# EasyEDA Pro project ProPrj_STM32H750.epro, board PCB1
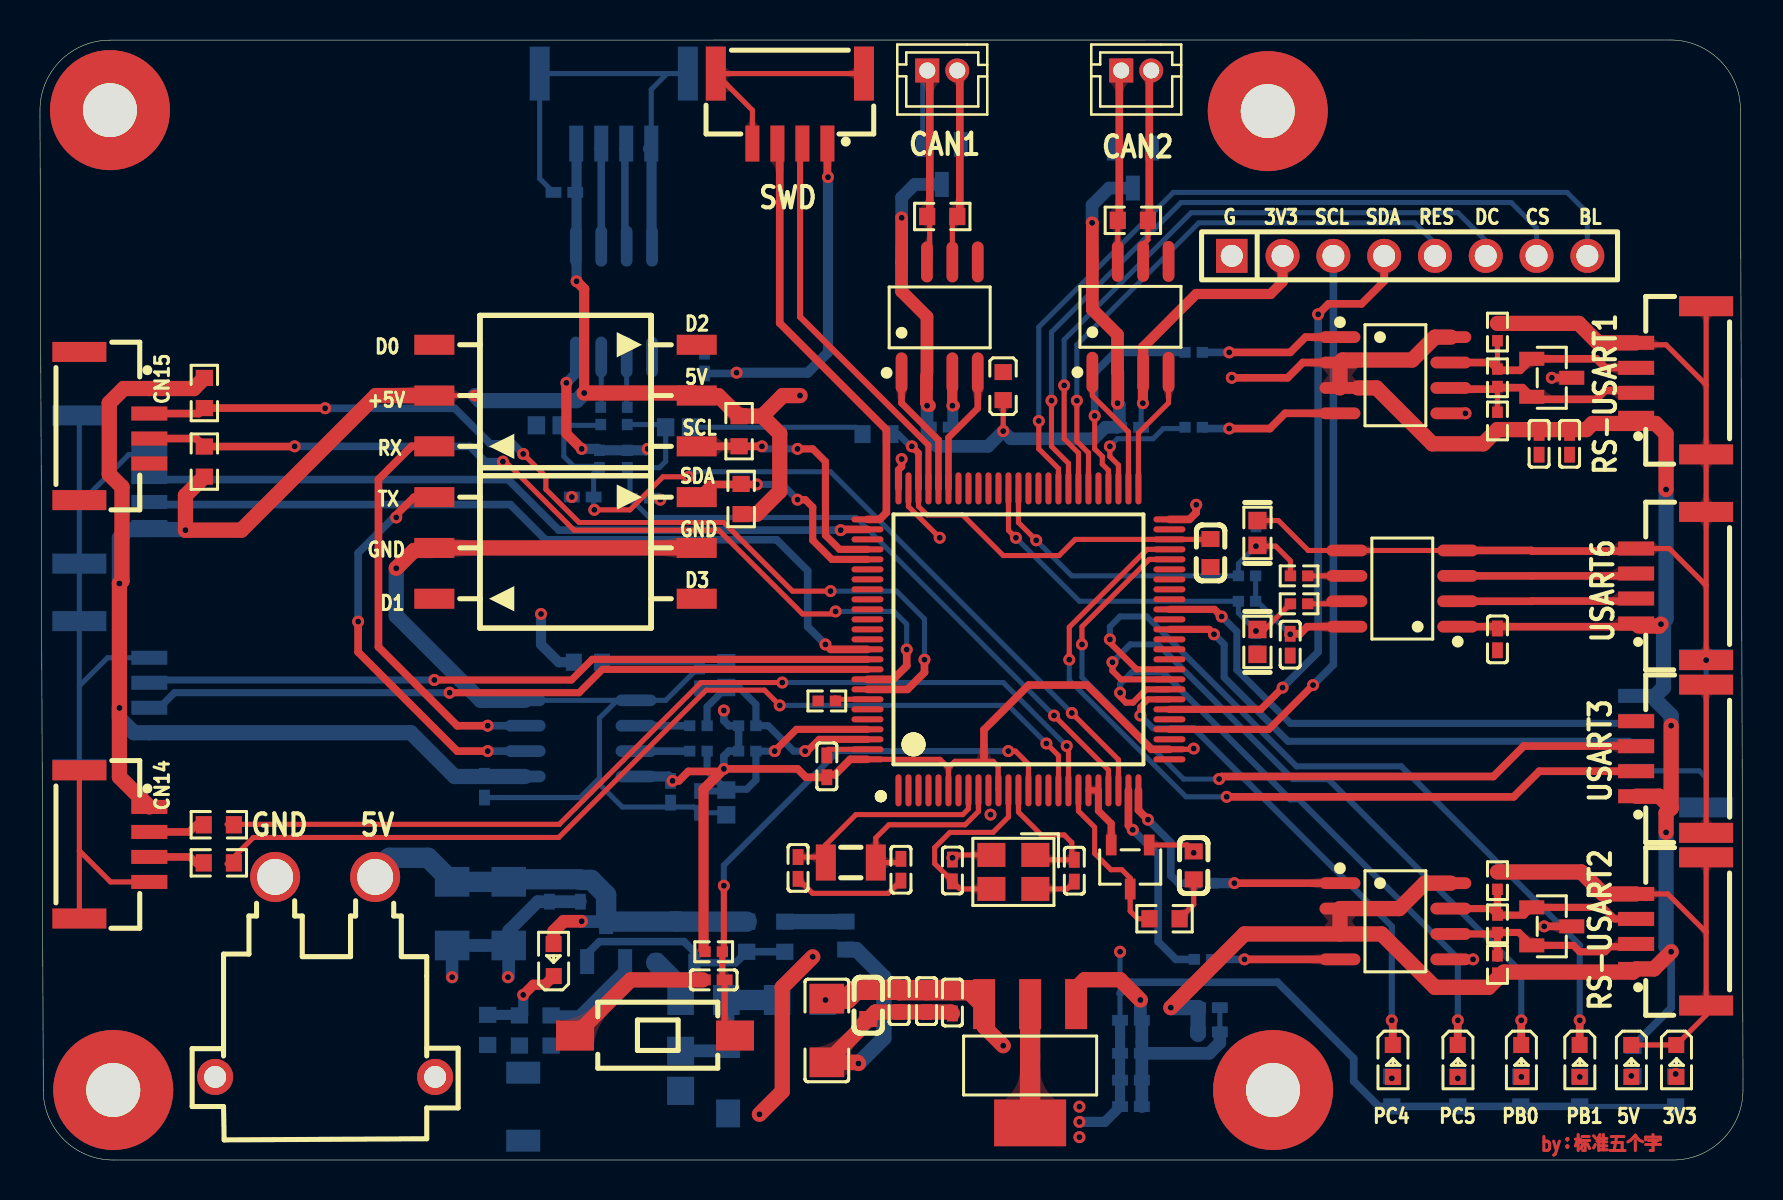
[diagram p1: board, top side]
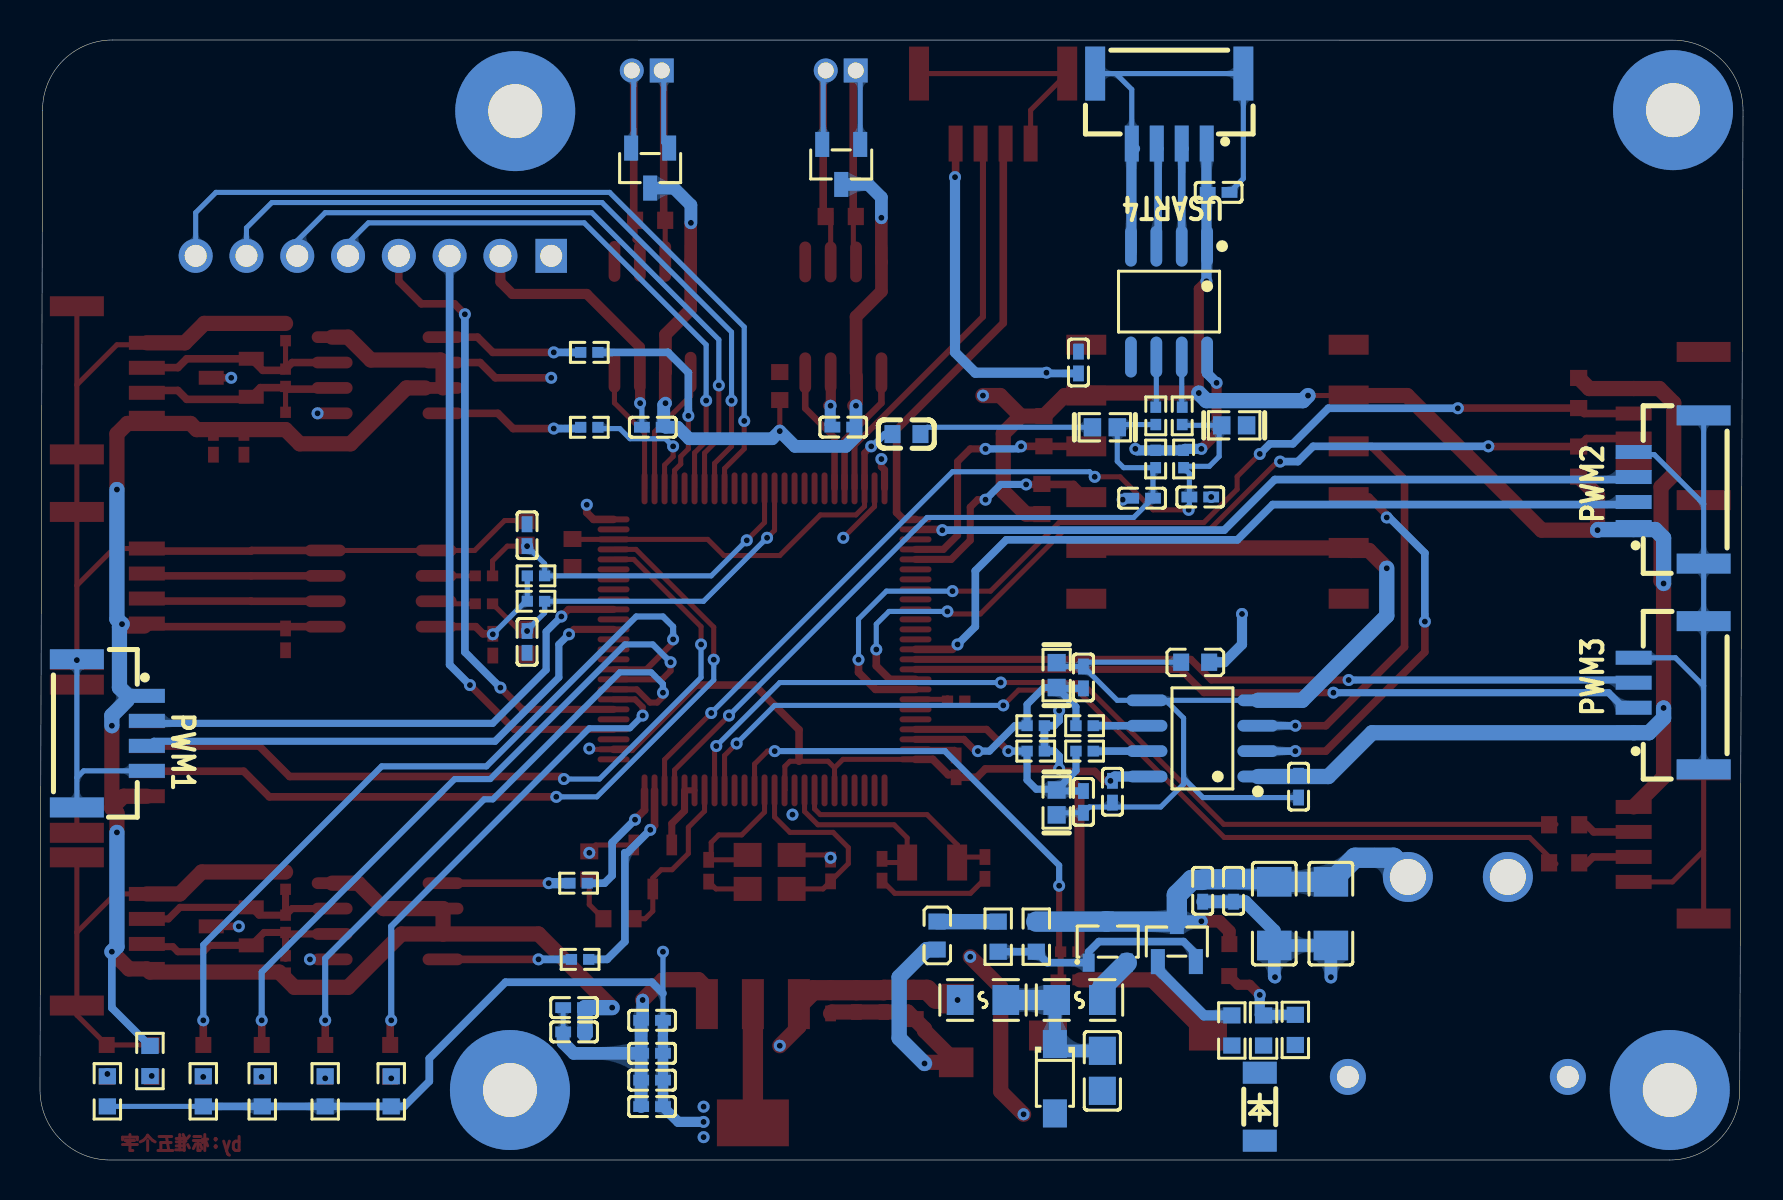
[diagram p2: board, bottom side, seen from below]

Outline 85.16 x 56.01 mm; copper layers: Top Layer, GND, VCC, Bottom Layer. Coordinates in mm from the lower left corner of the outline.
Outline path: 0,52.5 0,52.17 0.16,3.9 0.16,3.5 arc(1.19,1.03) 3.66,0 81.66,0 arc(84.14,1.03) 85.16,3.5 85.16,4.05 85.04,52.47 85.04,52.51 arc(84.01,54.98) 81.54,56.01 3.5,56 arc(1.03,54.97) 0,52.5
Stack: Top Layer 0.035mm 外层铜厚1oz / Dielectric1 0.2104mm 7628 RC49% 8.6mil / GND 0.0152mm 内层铜厚 / Dielectric2 1.065mm 1.1mm H/HOZ 含铜 / VCC 0.0152mm 内层铜厚 / Dielectric3 0.2104mm 7628 RC49% 8.6mil / Bottom Layer 0.035mm 外层铜厚1oz

## Design rules (mm)
net CAN1_TX: DP2
net CAN1_RX: DP2
net CAN2_TX: DP1
net CAN2_RX: DP1
net B1: DP4
net A1: DP4
net B2: DP3
net A2: DP3
template: 自定义配置
spacing copperThickness1oz (default): track to track 0.102, other pairs 0.152 to 0.3
spacing copperThickness2oz: track to track 0.203, other pairs 0.152 to 0.3
track width copperThickness1oz (default): min 0.127, default 0.254, max 2.54
track width copperThickness2oz: min 0.203, default 0.254, max 2.54
differential pair differentialPair (default): width min 0.127, default 0.254, max 2.54; gap min 0.152, default 0.152
via viaSize (default): diameter min 0.5, default 0.61, max 10; hole min 0.3, default 0.305, max 6.3

## Placement (name value [footprint] x y rotation side)
C1  100nF  [C0402]  76.49 35.81 90 top
C2  10nF  [C0402]  74.97 35.81 90 top
C3  100nF  [C0402]  54.56 2.67 180 bottom
C4  100nF  [C0402]  54.56 3.99 180 bottom
C5  100nF  [C0402]  54.56 5.33 180 bottom
C6  10nF  [C0402]  54.56 6.99 180 bottom
C7  100nF  [C0402]  39.35 19.69 90 top
C8  10uF  [C0603]  57.7 14.73 90 top
C11  100nF  [C0402]  45.63 7.87 90 top
C12  100nF  [C0402]  42.96 7.95 90 top
C13  10nF  [C0402]  44.33 7.95 90 top
C14  10uF  [C0603]  41.42 7.75 90 top
C15  100nF  [C0402]  33.69 9.01 180 top
C16  100nF  [C0402]  58.46 7.62 180 bottom
C17  10nF  [C0402]  58.46 6.41 180 bottom
C18  10uF  [C0603]  58.53 30.35 270 top
C19  10uF  [C0603]  41.83 36.3 180 bottom
C20  100nF  [C0402]  44.99 36.65 0 bottom
C21  100nF  [C0402]  54.52 36.64 180 bottom
C22  10uF  [C0805]  32.04 4.46 90 bottom
C23  47uF  [C1206]  23.44 12.32 90 bottom
C24  47uF  [C1206]  39.35 6.48 90 top
C25  47uF  [C1206]  20.61 12.32 90 bottom
C26  10nF  [C0402]  25.48 13.46 270 bottom
C27  100nF  [C0402]  27.02 13.46 270 bottom
C28  20pF  [C0402]  45.63 14.48 270 top
C29  20pF  [C0402]  51.72 14.47 270 top
C30  12pF  [C0402]  37.91 14.61 90 top
C31  12pF  [C0402]  43.05 14.52 90 top
C32  100nF  [C0402]  31.53 18.42 90 bottom
C33  100nF  [C0402]  22.23 18.67 270 bottom
C34  22pF  [C0402]  32.98 24.13 270 bottom
C35  22pF  [C0402]  32.98 17.91 90 bottom
C36  100nF  [C0402]  33.23 39.88 270 bottom
C37  100nF  [C0402]  26.22 48.39 180 bottom
C38  22pF  [C0402]  30.05 33.09 180 bottom
C39  22pF  [C0402]  27.14 33.15 0 bottom
C40  100nF  [C0402]  62.52 25.77 90 top
C41  100nF  [C0402]  72.88 26.04 270 top
C42  22pF  [C0402]  60.81 31.24 270 bottom
C43  22pF  [C0402]  60.81 25.91 90 bottom
CN1  B2B-ZR(LF)(SN)  [CONN-TH_B2B-ZR-LF-SN]  54.82 54.48 180 top
CN2  B2B-ZR(LF)(SN)  [CONN-TH_B2B-ZR-LF-SN]  45.12 54.48 180 top
CN3  XT30PW-M  [CONN-TH_XT30PW-M]  14.26 9.15 0 top
CN5  GH125-S04DCA-00  [CONN-SMD_4P-P1.27_GH125-S04DCA-00]  81.57 11.43 90 top
CN7  GH125-S04DCA-00  [CONN-SMD_4P-P1.27_GH125-S04DCA-00]  28.69 52.58 0 bottom
CN8  GH125-S04DCA-00  [CONN-SMD_4P-P1.27_GH125-S04DCA-00]  81.57 28.7 90 top
CN9  GH125-S04DCA-00  [CONN-SMD_4P-P1.27_GH125-S04DCA-00]  81.57 21.34 270 bottom
CN10  GH125-S04DCA-00  [CONN-SMD_4P-P1.27_GH125-S04DCA-00]  3.72 33.53 90 bottom
CN11  GH125-S04DCA-00  [CONN-SMD_4P-P1.27_GH125-S04DCA-00]  3.72 23.24 90 bottom
CN12  GH125-S04DCA-00  [CONN-SMD_4P-P1.27_GH125-S04DCA-00]  37.5 52.58 180 top
CN13  GH125-S04DCA-00  [CONN-SMD_4P-P1.27_GH125-S04DCA-00]  81.57 20.07 90 top
CN14  GH125-S04DCA-00  [CONN-SMD_4P-P1.27_GH125-S04DCA-00]  3.72 15.78 270 top
CN15  GH125-S04DCA-00  [CONN-SMD_4P-P1.27_GH125-S04DCA-00]  3.72 36.7 270 top
D1  SM712  [SOT-23-3_L2.9-W1.3-P1.90-LS2.4-BR]  75.6 39.12 180 top
D2  SM712  [SOT-23-3_L2.9-W1.3-P1.90-LS2.4-BR]  75.6 11.68 180 top
D3  PESD2CAN  [SOT-23-3_L2.9-W1.3-P1.90-LS2.4-BR]  45.1 49.78 90 bottom
D4  PESD2CAN  [SOT-23-3_L2.9-W1.3-P1.90-LS2.4-BR]  54.65 49.6 90 bottom
D5  ZMM68  [LL-34_L3.5-W1.5-RD]  24.17 2.67 270 bottom
D6  SMF5.0A  [SOD-123FL_L2.7-W1.8-LS3.8-RD]  34.41 4.06 270 bottom
D7  0603ESDA-05N  [D0603-BI]  34.32 24.25 270 bottom
D8  0603ESDA-05N  [D0603-BI]  34.32 17.88 90 bottom
D9  0603ESDA-05N  [D0603-BI]  31.91 36.64 180 bottom
D10  0603ESDA-05N  [D0603-BI]  25.45 36.74 0 bottom
D11  0603ESDA-05N  [D0603-BI]  60.88 31.36 270 top
D12  0603ESDA-05N  [D0603-BI]  60.88 25.91 90 top
F1  BSMD0805-100-12V  [F0805]  33.18 8 0 bottom
F2  BSMD0805-050-24V  [F0805]  38.01 8 0 bottom
H1  MF254V-11-08-1000-H70  [HDR-TH_8P-P2.54-V-F-3]  68.49 45.21 0 top
L1  3.3uH  [L0603]  40.3 11.22 270 bottom
L4  3.3uH  [L0603]  48.17 38.7 90 top
L5  3.3uH  [L0603]  27.4 24.89 0 bottom
LED1  NCD0603R1  [LED0603-RD_RED]  25.69 10 90 top
LED2  NCD0603R1  [LED0603-RD_RED]  67.65 4.95 270 top
LED3  NCD0603R1  [LED0603-RD_RED]  70.9 4.95 270 top
LED4  NCD0603R1  [LED0603-RD_RED]  74.08 4.95 270 top
LED5  NCD0603R1  [LED0603-RD_RED]  77 4.95 270 top
LED6  NCD0603R1  [LED0603-RD_RED]  81.83 4.95 270 top
LED7  NCD0603R1  [LED0603-RD_RED]  79.58 4.95 270 top
NOREF  -  [Pad_e1170]  3.66 3.5 0 top
NOREF#2  -  [Pad_e1554]  61.4 52.45 0 top
NOREF#3  -  [Pad_e1450]  61.66 3.5 0 top
NOREF#4  -  [Pad_e1690]  3.5 52.5 0 top
Q1  MMBT2907ALT1G  [SOT-23-3_L2.9-W1.3-P1.90-LS2.4-BR]  28.31 10.92 270 bottom
Q2  AO3401  [SOT-23-3_L2.9-W1.4-P1.90-LS2.6-BR]  31.77 10.92 270 bottom
R1  120Ω  [R0402]  72.88 39.12 90 top
R2  1kΩ  [R0402]  72.88 36.96 90 top
R3  1kΩ  [R0402]  72.88 41.4 90 top
R4  10Ω  [R0402]  57.69 40.39 0 bottom
R5  10Ω  [R0402]  57.69 36.64 0 bottom
R6  1kΩ  [R0402]  39.35 22.96 0 top
R7  10kΩ  [R0402]  33.69 10.41 180 top
R8  120Ω  [R0402]  72.88 11.81 90 top
R9  1kΩ  [R0402]  72.88 9.78 90 top
R10  1kΩ  [R0402]  72.88 13.97 90 top
R11  10Ω  [R0402]  58.23 13.84 0 bottom
R12  10Ω  [R0402]  58.16 10.03 0 bottom
R14  120Ω  [R0603]  45.12 47.18 180 top
R15  120Ω  [R0603]  54.65 46.99 0 top
R16  1kΩ  [R0603]  23.98 6.48 90 bottom
R17  1kΩ  [R0603]  22.39 6.51 90 bottom
R18  23.7kΩ  [R0603]  25.56 6.48 90 bottom
R19  23.7kΩ  [R0603]  37.25 11.17 270 bottom
R20  23.7kΩ  [R0603]  35.34 11.17 90 bottom
R21  100Ω  [R0402]  32.93 21.72 0 bottom
R22  100Ω  [R0402]  32.93 20.45 0 bottom
R23  10kΩ  [R0402]  35.37 20.45 180 bottom
R24  10kΩ  [R0402]  35.37 21.72 180 bottom
R25  100Ω  [R0402]  29.37 37.21 270 bottom
R26  100Ω  [R0402]  28.04 37.21 270 bottom
R27  10kΩ  [R0402]  27.98 35.05 90 bottom
R28  10kΩ  [R0402]  29.37 35.05 90 bottom
R29  100Ω  [R0402]  62.97 29.21 180 top
R30  100Ω  [R0402]  62.97 27.81 180 top
R31  10kΩ  [R0402]  60.36 27.94 0 bottom
R32  10kΩ  [R0402]  60.36 29.21 0 bottom
R33  0Ω  [R0603]  56.24 12.07 180 top
R34  4.7kΩ  [R0603]  34.96 36.44 90 top
R35  4.7kΩ  [R0603]  35.06 33.05 90 top
R36  470Ω  [R0603]  67.6 3.43 270 bottom
R37  470Ω  [R0603]  70.9 3.43 270 bottom
R38  470Ω  [R0603]  74.05 3.43 270 bottom
R39  470Ω  [R0603]  77 3.43 270 bottom
R40  0Ω  [R0603]  8.94 16.76 0 top
R41  0Ω  [R0603]  8.94 14.86 0 top
R42  0Ω  [R0603]  8.22 38.35 90 top
R43  0Ω  [R0603]  8.22 34.93 90 top
R44  470Ω  [R0603]  81.79 3.43 90 bottom
R45  470Ω  [R0603]  79.66 4.95 270 bottom
SW1  TS-1101-C-W  [SW-SMD_L6.0-W3.3-LS8.0]  30.76 6.22 180 top
U1  STM32H7B0VBT6  [LQFP-100_L14.0-W14.0-P0.50-LS16.0-BL]  48.93 26.04 0 top
U2  MAX13487EESA+T  [SOIC-8_L4.9-W3.9-P1.27-LS6.0-BL]  67.78 39.24 270 top
U3  AMS1117-3.3  [SOT-223-3_L6.5-W3.4-P2.30-LS7.0-BR]  49.51 4.83 90 top
U4  REF3033AIDBZR  [SOT-23-3_L3.0-W1.7-P0.95-LS2.9-BR]  54.52 14.65 90 top
U5  MAX13487EESA+T  [SOIC-8_L4.9-W3.9-P1.27-LS6.0-BL]  67.78 11.94 270 top
U6  SN65HVD230DR  [SOIC-8_L4.9-W3.9-P1.27-LS6.0-BL]  44.99 42.14 0 top
U7  SN65HVD230DR  [SOIC-8_L4.9-W3.9-P1.27-LS6.0-BL]  54.53 42.16 0 top
U8  3  [HDR-SMD_3P-P2.54-H-F-L11.5]  32.84 38.23 270 top
U9  1  [HDR-SMD_3P-P2.54-H-F-L11.5]  19.72 38.23 90 top
U10  2  [HDR-SMD_3P-P2.54-H-F-L11.5]  19.72 30.61 90 top
U11  4  [HDR-SMD_3P-P2.54-H-F-L11.5]  32.84 30.61 270 top
U12  π122M31  [SOIC-8_L4.9-W3.9-P1.27-LS6.0-BL]  27.03 21.08 90 bottom
U16  π122M31  [SOIC-8_L4.9-W3.9-P1.27-LS6.0-BL]  28.7 42.93 0 bottom
U17  π122M31  [SOIC-8_L4.9-W3.9-P1.27-LS6.0-BL]  68.13 28.58 90 top
USART3  GH125-S04DCA-00  [CONN-SMD_4P-P1.27_GH125-S04DCA-00]  81.57 38.99 90 top
X1  -  [CRYSTAL-SMD_4P-L3.2-W2.5-BL]  48.68 14.41 180 top
X2  32.768kHz  [FC-135R_L3.2-W1.5]  40.55 14.88 180 top

## Footprints (pads in the part's own frame, mm; a bottom-side part is the same pattern mirrored in y, then rotated)
C0402
  rect 0.79x0.54 smd: 1(-0.545,0) 2(0.545,0)
C0603
  rect 0.8x0.9 smd: 1(-0.7,0) 2(0.7,0)
C0805
  rect 1.41x1.35 smd: 1(-1,0) 2(1,0)
C1206
  rect 1.485x1.728 smd: 1(-1.593,0) 2(1.593,0)
CONN-SMD_4P-P1.27_GH125-S04DCA-00
  rect 0.7x1.8 smd: 1(-1.875,1.75) 2(-0.625,1.75) 3(0.625,1.75) 4(1.875,1.75)
  rect 1x2.7 smd: 5(3.705,-1.75) 6(-3.705,-1.75)
CONN-TH_B2B-ZR-LF-SN
  rect 1.2x1.2 hole 0.8: 1(0.75,0.001)
  round 1.2 hole 0.8: 2(-0.75,-0.001)
CONN-TH_XT30PW-M
  round 2.5 hole 1.8: 1(-2.5,5) 2(2.5,5)
  round 1.8 hole 1.1: 3(5.5,-5) 4(-5.5,-5)
CRYSTAL-SMD_4P-L3.2-W2.5-BL
  rect 1.4x1.2 smd: 1(-1.1,-0.85) 2(1.1,-0.85) 3(1.1,0.85) 4(-1.1,0.85)
D0603-BI
  rect 0.873x0.907 smd: 1(-0.622,0) 2(0.622,0)
F0805
  rect 1.335x1.5 smd: 1(-1.143,0) 2(1.143,0)
FC-135R_L3.2-W1.5
  rect 1x1.8 smd: 1(-1.25,0) 2(1.25,0)
HDR-SMD_3P-P2.54-H-F-L11.5
  rect 1x2 smd: 1(-2.54,0) 2(0,0) 3(2.54,0)
HDR-TH_8P-P2.54-V-F-3
  rect 1.575x1.7 hole 1.1: 1(-8.89,0)
  round 1.7 hole 1.1: 2(-6.35,0) 3(-3.81,0) 4(-1.27,0) 5(1.27,0) 6(3.81,0) 7(6.35,0) 8(8.89,0)
L0603
  rect 0.8x0.864 smd: 1(-0.7,0) 2(0.7,0)
LED0603-RD_RED
  rect 0.8x0.8 smd: 1(-0.799,-0.004) 2(0.799,0.004)
LL-34_L3.5-W1.5-RD
  rect 1.1x1.7 smd: 1(-1.7,0) 2(1.7,0)
LQFP-100_L14.0-W14.0-P0.50-LS16.0-BL
  oval 0.3x1.6 smd: 1(-6,-7.55) 2(-5.5,-7.55) 3(-5,-7.55) 4(-4.5,-7.55) 5(-4,-7.55) 6(-3.5,-7.55) 7(-3,-7.55) 8(-2.5,-7.55) 9(-2,-7.55) 10(-1.5,-7.55) 11(-1,-7.55) 12(-0.5,-7.55) 13(0,-7.55) 14(0.5,-7.55) 15(1,-7.55) 16(1.5,-7.55) 17(2,-7.55) 18(2.5,-7.55) 19(3,-7.55) 20(3.5,-7.55) 21(4,-7.55) 22(4.5,-7.55) 23(5,-7.55) 24(5.5,-7.55) 25(6,-7.55) 51(6,7.55) 52(5.5,7.55) 53(5,7.55) 54(4.5,7.55) 55(4,7.55) 56(3.5,7.55) 57(3,7.55) 58(2.5,7.55) 59(2,7.55) 60(1.5,7.55) 61(1,7.55) 62(0.5,7.55) 63(0,7.55) 64(-0.5,7.55) 65(-1,7.55) 66(-1.5,7.55) 67(-2,7.55) 68(-2.5,7.55) 69(-3,7.55) 70(-3.5,7.55) 71(-4,7.55) 72(-4.5,7.55) 73(-5,7.55) 74(-5.5,7.55) 75(-6,7.55)
  oval 1.6x0.3 smd: 26(7.55,-6) 27(7.55,-5.5) 28(7.55,-5) 29(7.55,-4.5) 30(7.55,-4) 31(7.55,-3.5) 32(7.55,-3) 33(7.55,-2.5) 34(7.55,-2) 35(7.55,-1.5) 36(7.55,-1) 37(7.55,-0.5) 38(7.55,0) 39(7.55,0.5) 40(7.55,1) 41(7.55,1.5) 42(7.55,2) 43(7.55,2.5) 44(7.55,3) 45(7.55,3.5) 46(7.55,4) 47(7.55,4.5) 48(7.55,5) 49(7.55,5.5) 50(7.55,6) 76(-7.55,6) 77(-7.55,5.5) 78(-7.55,5) 79(-7.55,4.5) 80(-7.55,4) 81(-7.55,3.5) 82(-7.55,3) 83(-7.55,2.5) 84(-7.55,2) 85(-7.55,1.5) 86(-7.55,1) 87(-7.55,0.5) 88(-7.55,0) 89(-7.55,-0.5) 90(-7.55,-1) 91(-7.55,-1.5) 92(-7.55,-2) 93(-7.55,-2.5) 94(-7.55,-3) 95(-7.55,-3.5) 96(-7.55,-4) 97(-7.55,-4.5) 98(-7.55,-5) 99(-7.55,-5.5) 100(-7.55,-6)
Pad_e1170
  round 6 hole 2.7: 101(0,0)
Pad_e1450
  round 6 hole 2.7: 101(0,0)
Pad_e1554
  round 6 hole 2.7: 101(0,0)
Pad_e1690
  round 6 hole 2.7: 101(0,0)
R0402
  rect 0.566x0.54 smd: 1(-0.433,0) 2(0.433,0)
R0603
  rect 0.806x0.864 smd: 1(-0.753,0) 2(0.753,0)
SOD-123FL_L2.7-W1.8-LS3.8-RD
  rect 1.4x1.2 smd: 1(-1.735,0) 2(1.735,0)
SOIC-8_L4.9-W3.9-P1.27-LS6.0-BL
  oval 0.588x2.045 smd: 1(-1.905,-2.772) 2(-0.635,-2.772) 3(0.635,-2.772) 4(1.905,-2.772) 5(1.905,2.772) 6(0.635,2.772) 7(-0.635,2.772) 8(-1.905,2.772)
SOT-23-3_L2.9-W1.3-P1.90-LS2.4-BR
  rect 1.25x0.7 smd: 1(1,-0.95) 2(1,0.95) 3(-1,0)
SOT-23-3_L2.9-W1.4-P1.90-LS2.6-BR
  rect 0.91x0.6 smd: 1(1.055,-0.955) 2(1.055,0.955) 3(-1.055,0)
SOT-23-3_L3.0-W1.7-P0.95-LS2.9-BR
  rect 1.038x0.532 smd: 1(1.101,-0.95) 2(1.101,0.95) 3(-1.101,0)
SOT-223-3_L6.5-W3.4-P2.30-LS7.0-BR
  rect 2.5x1.1 smd: 1(2.97,-2.3) 2(2.97,0) 3(2.97,2.3)
  rect 2.34x3.6 smd: 4(-2.97,0)
SW-SMD_L6.0-W3.3-LS8.0
  rect 1.9x1.5 smd: 1(-4,0) 2(4,0)

## Nets
As in the schematic.

Pads without a net: NOREF 101; NOREF#2 101; NOREF#3 101; NOREF#4 101; U1 1 2 3 4 5 7 15 16 28 30 36 37 38 40 42 43 44 45 55 60 61 62 65 66 67 68 69 78 81 82 83 84 85 86 87 88 95 96; U6 5; U7 5

## Via types
v1: diameter 0.6, hole 0.3, Top Layer to Bottom Layer, 132 vias

## Routing (per net, layer and track width the routed paths; a pad name or vN(x,y) marks a point on that pad's centre or on a via; arc(x,y) is an arc through that point)
3.3V: length 220.1
  Top Layer w0.254: 45.62,37.72 v1(45.63,37.72) ; U1.100 45.01,20.04 45.43,19.61 ; v1(57.69,20.57) 57.65,20.54 U1.27 ; U1.11 47.91,18.5 47.91,19.69 47.66,19.94 45.76,19.94 45.43,19.61 ; U1.6 45.43,19.61 ; C8.2 57.37,15.75 U4.1 ; U7.3 55.15,39.38
  Top Layer w0.355: U1.75 42.93,34.51 43.09,34.67 v1(43.09,35.05)
  Top Layer w0.381: U17.8 63.37,26.67 63.01,26.31 C40.2 ; U1.50 57.48,32.04 57.82,32.37 v1(57.82,32.77) ; v1(31.63,18.96) 31.95,18.96 32.42,19.43 34.07,19.43 v1(34.2,19.56) 37.89,19.56 38.31,19.14 39.35,19.14 ; 47.21,19.94 47.21,21.52 49.44,23.75 52.36,23.75 55.57,20.54 U1.27 ; CN12.1 39.38,49.18 v1(39.41,49.15) ; 39.35,19.27 39.75,19.27 40.52,20.04 U1.100
  Top Layer w0.508: v1(27.09,35.56) 26.32,36.32 v1(26.32,38.86) ; U7.3 55.17,40.65 57.82,43.31 61.54,43.31 62.14,43.91 H1.2 ; 45.75,37.72 45.62,37.86 45.62,39.23 ; 55.15,39.38 v1(55.15,37.85) ; R7.2 33.18,10.49 33.18,18.54 34.07,19.43
  Top Layer w1.016: U3.2 U3.4
  VCC w0.508: 54.01,34.8 55.79,34.8 v1(57.82,32.77) 57.82,31.85 62.52,27.15 v1(62.52,26.29) 62.52,26.04 57.69,21.21 v1(57.69,20.57) v1(57.69,15.36) 57.69,14.57 54.01,10.89 v1(54.01,10.41) ; 54.01,34.8 55.15,35.94 v1(55.15,37.85) ; 54.01,34.8 46.9,34.8 ; v1(45.63,37.72) 45.63,36.07 46.9,34.8 ; 46.9,34.8 43.34,34.8 v1(43.09,35.05) 39.58,35.05 35.26,39.37 v1(34.83,39.37) 31.91,39.37 30.39,37.85 v1(30.39,35.56)
  Bottom Layer w0.254: R44.1 R39.2 ; v1(54.01,10.41) C6.2 ; 54.81,36.64 C21.1 55.06,37.76 v1(55.15,37.85) ; R32.2 R31.2 60.87,27.94 v1(62.52,26.29)
  Bottom Layer w0.381: 54.01,8.33 54.57,8.89 61.88,8.89 65.69,5.08 65.69,3.94 66.95,2.68 R36.2 R37.2 R38.2 R39.2 ; v1(34.2,19.56) 34.2,20.19 34.45,20.45 R23.2 R24.2 34.45,21.72 34.2,21.97 v1(34.2,22.48) ; C36.2 34.8,39.33 v1(34.83,39.37)
  Bottom Layer w0.508: v1(27.09,35.56) 27.9,35.56 R27.2 R28.2 30.31,35.49 v1(30.39,35.56) ; 45.67,37.66 45.67,36.78 45.63,36.74 v1(45.63,37.72) ; v1(39.41,49.15) 39.41,40.39 38.39,39.37 v1(34.83,39.37) ; v1(51.98,1.91) 53.24,1.91 C3.2 C4.2 54.01,4 54.01,6.22 54.01,6.22 C6.2 ; U16.8 26.8,39.34 v1(26.32,38.86) ; U12.8 31.42,19.18 v1(31.63,18.96)
  vias: v1(51.98,2.67) v1(51.98,1.14)
+5V: length 267.3
  Top Layer w0.254: U9.2 v1(21.75,38.23) ; 45.63,8.49 C11.2 ; 72.79,26.67 C41.1 ; 41.49,8.51 41.51,8.49
  Top Layer w0.381: U2.2 63.15,39.88 62.39,39.12 v1(59.6,39.12) ; CN8.1 79.66,26.67 U17.1
  Top Layer w0.508: v1(26.83,43.94) 27.21,43.56 v1(27.21,38.35)
  Top Layer w0.762: v1(81.32,16.38) 81.32,17.35 81.57,17.6 ; 36.12,37.2 36.99,36.32 36.99,33.44 35.85,32.3 R35.1 ; 36.12,37.2 37.15,38.23 v1(38.01,38.23) ; 36.12,37.2 R34.2 34.95,37.2 33.92,38.23 U8.2 32.71,38.35 v1(27.21,38.35) ; U5.8 69.25,13.84 67.98,12.57 U5.2 U5.3 ; U2.8 69.76,41.15 68.62,40.01 65.13,40.01 U2.2 U2.3 ; R42.2 7.69,38.58 CN15.1 4.19,38.58 3.46,37.86 3.46,34.29 4.1,33.66 4.1,28.96 v1(3.97,28.83) v1(3.97,22.61) 3.97,19.15 CN14.1 ; 81.57,17.6 80.98,18.19 CN13.1 ; 81.57,17.6 v1(81.57,21.72) ; v1(48.17,5.72) 47.21,6.67 47.21,7.8 ; R43.1 7.27,33.23 v1(7.27,31.5) 10.07,31.5 16.8,38.23 U9.2 ; U5.3 60.23,11.3 v1(56.55,7.62) ; U5.3 67.09,11.3 69.76,8.64 72.44,8.64 73.2,9.4 79.66,9.4 CN5.1 80.71,9.56 v1(81.57,10.41) ; v1(81.06,26.8) 80.96,26.7 79.95,26.7 ; 65.9,38.61 66.84,38.61 69.63,35.81 72.17,35.81 72.88,36.52 77.33,36.52 77.63,36.83 80.79,36.83 81.32,36.31 v1(81.32,33.53)
  Top Layer w1.016: C24.2 40.36,8.07 40.8,8.51 42.94,8.51 C12.2 C13.2 46.52,8.49 47.21,7.8
  VCC w0.762: v1(38.01,38.23) 42.76,38.23 44.2,39.67 57.96,39.67 58.52,39.12 v1(59.6,39.12) ; v1(48.17,5.72) 54.52,5.72 56.42,7.62 v1(56.55,7.62)
  Bottom Layer w0.254: CN9.1 80.78,23.21
  Bottom Layer w0.381: R45.1 81.57,7.61 v1(81.57,10.41)
  Bottom Layer w0.508: v1(26.83,43.94) 26.83,50.57
  Bottom Layer w0.762: v1(21.75,38.23) 22.01,37.97 26.83,37.97 v1(27.21,38.35) ; v1(81.57,10.41) 81.32,10.67 v1(81.32,16.38) ; 57.91,6.28 C16.2 v1(56.55,7.62) ; 80.81,22.99 81.57,22.23 v1(81.57,21.72) ; v1(7.27,31.5) 7.24,31.53 4.39,31.53 3.97,31.11 v1(3.97,28.83) ; v1(81.32,33.53) 81.32,27.05 v1(81.06,26.8) 81.19,26.67 81.19,23.62 80.78,23.21 ; U12.1 20.74,19.18 18.55,21.37 CN11.1 4.7,21.37 3.97,22.1 v1(3.97,22.61)
  vias: v1(39.28,8)
AGND: length 239.6
  Top Layer w0.254: 83.32,28.73 v1(83.32,25) ; 83.32,28.73 CN8.5 83.32,38.76 ; 83.32,28.73 81.47,30.58 CN8.4 ; U1.99 39.42,20.54 39.35,20.46 C7.2 ; 1.97,15.47 CN14.5 ; 1.97,15.47 CN14.6 ; 1.97,15.47 3.53,13.91 CN14.4 ; 80.01,40.77 81.32,40.77 83.32,38.76 ; CN5.5 83.32,11.39 ; 83.32,11.39 81.4,13.31 CN5.4 ; 83.32,11.39 CN5.6 83.32,7.25 LED6.1 LED7.1 ; 56.99,12.07 57.7,12.77 C8.1 ; C29.2 51.36,13.56 X1.4 ; 83.32,38.76 83.32,42.41 ; CN12.4 35.63,52.5 CN12.5 CN12.6 ; D11.1 61.93,31.98 63.42,30.48 U17.5 U17.4 ; v1(45.63,15.11) 45.77,15.26 47.58,15.26 ; CN13.5 CN13.6 ; U1.74 43.43,32.68 v1(44.99,31.12) ; C30.1 38.63,13.34 42.42,13.34 C31.1
  Top Layer w0.381: v1(75.22,11.68) D2.3 ; CN8.4 79.69,30.45 74.61,30.45 74.58,30.48 U17.4 ; v1(75.6,39.12) D1.3
  Top Layer w0.762: v1(55.03,8) 54.01,9.02 52.23,9.02 51.81,8.6 U3.1 ; USART3.4 77.92,40.86 76.95,41.84 R3.2 ; SW1.2 29.54,9.01 C15.2 ; C11.1 45.56,7.4 C13.1 C12.1 41.77,7.4 C14.1 40.93,6.56 40.93,6.47 C24.1 40.87,4.88 v1(40.93,4.83) ; R10.2 77.07,14.4 78.17,13.31 CN5.4
  Bottom Layer w0.254: 31.36,54.33 CN7.5 ; 31.36,54.33 CN7.6 24.99,49.08 C37.2 ; 31.36,54.33 30.57,53.53 CN7.4 ; 1.97,23.7 CN11.5 1.97,32.8 ; 1.97,23.7 3.38,25.12 CN11.4 ; 1.97,23.7 CN11.6 ; D9.1 40.79,36.64 C19.2 ; CN9.4 82.98,19.46 83.32,19.12 ; C16.1 C17.1 ; 83.32,19.12 CN9.5 ; 83.32,19.12 v1(83.32,25) ; v1(31.02,33.02) 30.95,33.09 C38.1 ; 5.47,35.28 4.44,35.28 1.97,32.8 ; 55.1,5.9 55.1,5.9 ; 1.97,32.8 1.97,37.11
  Bottom Layer w0.508: 30.4,50.57 30.58,50.39 30.58,45.38 ; L5.1 25.94,24.89 25.05,25.78 v1(25.05,27.31)
  Bottom Layer w0.635: C3.1 C4.1 C5.1 ; v1(55.03,8) 55.03,7.06 C6.1 C5.1 ; C5.1 58.47,5.33 59,5.86 C17.1
  Bottom Layer w0.762: v1(40.93,4.83) 42.2,6.1 42.2,9.14 40.82,10.52 L1.2
  vias: v1(26.6,33.15) v1(47.53,17.27) v1(71.28,37.34) v1(71.66,10.03)
GND: length 23
  Top Layer w0.762: v1(35.98,2.29) 37.12,3.43 37.12,8.64 v1(38.64,10.16)
  Bottom Layer w0.635: v1(20.61,9.14) C25.1 C23.1 ; C23.1 23.44,9.18 v1(23.4,9.14) ; C23.1 23.44,11.47 24.89,12.92 C26.2 C27.2
  Bottom Layer w0.762: L1.1 40.3,11.92 R19.1
SGND2: length 40.8
  Top Layer w0.254: 48.3,38 48.17,37.87 v1(48.17,36.45) ; 44.35,37.72 v1(44.36,37.72)
  Top Layer w0.635: v1(43.09,47.12) 43.09,44.91 U6.8 43.09,43.44 44.35,42.17 U6.2 ; 44.48,37.72 44.33,37.88 44.33,39.21 ; v1(53.88,37.85) 53.9,37.86 U7.2 53.88,39.4 53.88,41.28 52.63,42.53 U7.8 52.63,46.85 v1(52.61,46.86)
  Bottom Layer w0.635: D3.3 43.74,48.78 43.09,48.13 v1(43.09,47.12) ; v1(53.88,37.85) 53.97,37.76 53.97,36.75 53.87,36.64 53.27,36.64 52.7,36.07 48.55,36.07 v1(48.17,36.45) 47.41,35.69 44.87,35.69 44.36,36.2 v1(44.36,37.72) ; D4.3 53.46,48.6 52.61,47.75 v1(52.61,46.86)
SGND3: length 8.6
  Top Layer w0.254: R33.2 54.9,12.07 54.52,12.45 U4.3 54.52,14.1 54.1,14.52 53.55,14.52 52.74,15.33 52.74,16.64 51.93,17.45 U1.19
SGND4: length 59.5
  Top Layer w0.762: v1(17.82,29.59) 18.7,30.48 19.59,30.48 U10.2 U11.2
  Bottom Layer w0.254: D7.1 34.13,24.68 C34.1 ; 28.86,22.99 27.98,22.1 27.98,19.1 ; 28.86,22.99 U12.5 31.29,22.99 C34.1 ; 28.86,22.99 U12.4 ; 27.98,19.1 27.98,18.8 29.12,17.65 32.69,17.65 C35.1 34.22,17.36 D8.1 ; 27.98,19.1 27,18.12 C33.2 ; L5.2 32.77,24.89 C34.1
  Bottom Layer w0.762: U12.4 22.04,22.99 17.82,27.21 v1(17.82,29.59)
3.3REF: length 3.5
  Top Layer w0.305: U1.20 U1.21
  Top Layer w0.355: U4.2 53.57,16.83 52.93,17.46 U1.21
+5.V: length 2.4
  Bottom Layer w1.016: Q2.2 32.04,8.64 F1.1
A1: length 11.2
  Top Layer w0.254: R2.2 72.88,38.53 72.81,38.61 R1.1
  Top Layer w0.381: R1.1 72.94,38.62 74.14,38.62 D1.2 74.73,38.04 77.83,38.04 78.27,38.48 79.82,38.48 USART3.2 ; U2.6 70.61,38.55 72.75,38.55 72.81,38.61
A2: length 11.1
  Top Layer w0.355: 72.88,10.09 72.88,11.23 72.81,11.3 ; 72.81,11.3 U5.6 ; 72.81,11.3 R8.1 73.96,11.38 D2.2 76.68,10.73 77,10.41 78.27,10.41 78.52,10.67 79.68,10.67 CN5.2
ADC2_INN1: length 48.3
  Top Layer w0.254: U1.17 50.93,20.23 v1(50.33,20.83) ; 9.35,14.81 10.67,16.13 25.94,16.13 33.31,23.5 36.23,23.5 v1(36.99,22.73)
  Bottom Layer w0.254: v1(50.33,20.83) 48.42,22.73 v1(36.99,22.73)
ADC2_INP1: length 48.5
  Top Layer w0.254: 9.35,16.79 25.96,16.79 33.06,23.88 v1(37.12,23.88) ; v1(51.34,20.7) 51.43,20.61 U1.18
  Bottom Layer w0.254: v1(51.34,20.7) 48.17,23.88 v1(37.12,23.88)
B1: length 11
  Top Layer w0.254: R3.1 R1.2
  Top Layer w0.381: 79.53,39.62 78.27,39.62 77.83,40.07 74.6,40.07 74.02,39.49 72.94,39.49 R1.2 72.55,39.88 U2.7
B2: length 11.1
  Top Layer w0.355: U5.7 72.55,12.57 R8.2 ; R8.2 R10.1 ; R8.2 74.21,12.24 D2.1 78.16,12.63 78.74,12.06 CN5.3
BL: length 41.3
  Top Layer w0.254: U1.59 50.93,34.58 49.95,35.56 v1(49.95,36.96)
  Bottom Layer w0.254: v1(49.95,36.96) 49.95,41.66 56.68,48.39 76.36,48.39 77.38,47.37 H1.8
BOOT0: length 1.6
  Top Layer w0.254: 39.78,23.11 39.86,23.04 U1.94
CAN1_RX: length 6.4
  Top Layer w0.33: U1.70 45.43,36.12 46.9,37.59 U6.4
CAN1_TX: length 6.5
  Top Layer w0.33: U1.71 44.93,36 43.09,37.85 U6.1
CAN2_RX: length 6.4
  Top Layer w0.254: U7.4 56.44,37.86 54.93,36.35 U1.51
CAN2_TX: length 6.6
  Top Layer w0.254: U1.52 54.43,36.41 52.63,38.21 U7.1
CS: length 37
  Top Layer w0.254: U1.58 51.43,34.84 50.58,35.69 v1(50.58,37.97)
  Bottom Layer w0.254: H1.7 74.84,46.61 73.57,47.88 57.06,47.88 50.58,41.4 v1(50.58,37.97)
DC: length 32.8
  Top Layer w0.254: v1(51.22,38.74) 51.22,36.07 51.93,35.35 U1.57
  Bottom Layer w0.254: H1.6 72.3,45.97 70.9,47.37 57.57,47.37 51.22,41.02 v1(51.22,38.74)
I2C1_SCL: length 46.2
  Top Layer w0.254: v1(23.15,34.93) 23.28,34.93 26.71,31.5 33.94,31.5 38.14,27.31 39.66,27.31 v1(39.79,27.43)
  Top Layer w0.381: CN15.3 7.82,36.08 R43.2 12.73,35.68 v1(12.74,35.69) ; v1(43.34,25.53) 43.34,24.71 42.67,24.04 U1.92
  Bottom Layer w0.254: v1(39.79,27.43) 42.71,27.43 43.34,26.8 v1(43.34,25.53)
  Bottom Layer w0.381: v1(12.74,35.69) 21.5,35.69 22.26,34.93 v1(23.15,34.93)
I2C1_SDA: length 49.5
  Top Layer w0.254: v1(39.53,28.45) 37.63,28.45 34.2,31.88 26.96,31.88 25.3,33.54 25.3,34.17 v1(24.17,35.31)
  Top Layer w0.381: v1(44.23,25.02) 44.23,24.38 43.38,23.54 U1.93 ; v1(14.26,37.59) 14.25,37.6 R42.1 7.95,37.33 CN15.2
  Bottom Layer w0.254: v1(39.53,28.45) 42.83,28.45 44.23,27.05 v1(44.23,25.02)
  Bottom Layer w0.381: v1(24.17,35.31) 23.66,35.81 22.51,35.81 20.74,37.59 v1(14.26,37.59)
IN_5+: length 24.3
  Top Layer w0.635: v1(27.09,11.94) 26.19,11.94 25.69,11.43 LED1.2
  Bottom Layer w0.254: 31.82,11.92 Q2.3
  Bottom Layer w0.635: v1(27.09,11.94) 27.1,11.92 Q1.3
  Bottom Layer w1.016: 26.99,14.04 23.57,14.04 C23.2 C25.2 19.41,15.11 17.47,15.11 16.89,14.53 ; C27.1 27.56,14.01 28.31,13.25 Q1.3 ; R20.2 31.83,11.92 31.82,11.92 28.4,11.92
LED1: length 24.9
  Top Layer w0.305: U1.32 55.41,23.04 55.03,22.66 v1(55.03,22.23)
  Top Layer w0.381: v1(67.6,6.99) 67.65,6.94 LED2.1
  Bottom Layer w0.305: v1(55.03,22.23) 55.66,21.59 57.69,21.59 67.6,11.68 v1(67.6,6.99)
LED2: length 30.9
  Top Layer w0.305: v1(54.01,23.37) 54.01,23.17 54.3,22.88 54.66,22.88 55.32,23.54 U1.33
  Top Layer w0.381: v1(70.9,6.99) 70.9,6.98 LED3.1
  Bottom Layer w0.305: v1(70.9,6.99) 70.9,10.08 62.95,18.03 62.52,18.03 56.17,24.38 54.6,24.38 54.01,23.8 v1(54.01,23.37)
LED3: length 34.7
  Top Layer w0.305: U1.34 54.06,24.04 53.63,24.46 v1(53.63,24.89)
  Top Layer w0.381: v1(74.08,6.99) 74.07,6.98 LED4.1
  Bottom Layer w0.305: v1(74.08,6.99) 74.08,9.4 64.42,19.05 62.65,19.05 55.92,25.78 54.52,25.78 v1(53.63,24.89)
LED4: length 39.8
  Top Layer w0.305: U1.35 54.84,24.54 53.5,25.87 v1(53.5,26.04)
  Top Layer w0.381: LED5.1 77,5.76 v1(77,6.99)
  Bottom Layer w0.305: v1(77,6.99) 77,10.76 68.07,19.69 62.84,19.69 55.35,27.18 54.01,27.18 53.5,26.67 v1(53.5,26.04)
NRST: length 28
  Top Layer w0.254: U1.14 49.43,19.8 48.78,20.45 v1(48.42,20.45)
  Top Layer w0.305: v1(34.2,13.72) 34.2,10.49 R7.1 34.12,9.12 C15.1 34.24,6.74 SW1.1
  Bottom Layer w0.305: v1(48.42,20.45) 39.91,20.45 34.2,14.73 v1(34.2,13.72)
OSC32_IN: length 11.2
  Top Layer w0.254: U1.8 46.43,17.56 46.14,17.27 40.8,17.27 39.28,15.75 39.28,14.9 ; 39.28,14.9 39.02,15.15 C30.2 ; 39.28,14.9 X2.2
OSC32_OUT: length 9.3
  Top Layer w0.254: C31.2 42.87,14.88 X2.1 41.8,16.11 42.45,16.76 46.26,16.76 46.93,17.43 U1.9
OSC_IN: length 9.8
  Top Layer w0.254: X1.3 46,13.56 C28.2 44.74,14.82 44.74,15.62 45.5,16.38 47.66,16.38 48.43,17.15 U1.12
OSC_OUT: length 7.4
  Top Layer w0.254: 49.78,15.26 50.02,15.01 C29.1 51.6,15.14 51.6,15.88 51.22,16.26 50.07,16.26 48.93,17.4 U1.13
RES: length 28.9
  Top Layer w0.254: U1.56 52.43,35.36 51.85,35.94 v1(51.85,37.97)
  Bottom Layer w0.254: v1(51.85,37.97) 51.85,40.77 57.95,46.86 68.74,46.86 69.76,45.85 H1.5
RX: length 20.8
  Top Layer w0.381: v1(22.39,21.72) 20.86,21.72 16.93,25.65 16.93,34.04 18.58,35.69 U9.1
  Bottom Layer w0.381: v1(22.39,21.72) U12.3
SCL: length 30
  Top Layer w0.355: v1(63.66,23.75) 61.45,21.54 U1.29
  Bottom Layer w0.381: v1(63.66,23.75) 64.68,24.77 H1.3
SCL1: length 12.8
  Top Layer w0.355: U1.79 39.99,30.54 39.28,31.24 39.28,34.93 38.64,35.56 v1(37.88,35.56)
  Top Layer w0.381: 34.96,35.69 R34.1 ; 34.96,35.69 U8.3 ; 34.96,35.69 v1(36.1,35.69)
  Bottom Layer w0.355: v1(36.1,35.69) 36.23,35.56 v1(37.88,35.56)
SDA: length 30.8
  Top Layer w0.355: U1.31 61.05,22.54 v1(62.14,23.62)
  Top Layer w0.381: H1.4 67.22,43.94 66.09,42.82 64.44,42.82 v1(63.92,42.29)
  Bottom Layer w0.381: v1(62.14,23.62) 63.92,25.4 v1(63.92,42.29)
SDA1: length 11.3
  Top Layer w0.355: U1.80 39.6,30.04 38.64,30.99 38.64,32.65 38.27,33.02 v1(37.88,33.02)
  Top Layer w0.381: U11.1 33.48,33.78 v1(35.85,33.78)
  Bottom Layer w0.355: v1(37.88,33.02) 37.12,33.78 v1(35.85,33.78)
SWCLK: length 21.4
  Top Layer w0.381: U1.76 41.99,32.04 42.33,32.37 42.33,36.52 36.99,41.85 36.99,50.46
SWDIO: length 20
  Top Layer w0.305: U1.72 44.43,35.74 38.01,42.16 38.01,50.71 CN12.2
TIM1_CH1: length 26.8
  Top Layer w0.355: v1(58.71,26.29) 58.46,26.54 U1.39
  Bottom Layer w0.355: 79.82,20.58 79.46,20.94 62.41,20.94 59.22,24.13 59.22,25.78 v1(58.71,26.29)
TIM1_CH2: length 26.8
  Top Layer w0.355: v1(59.09,27.18) 58.73,27.54 U1.41
  Bottom Layer w0.355: v1(59.09,27.18) 59.09,27.18 59.85,26.42 59.85,24.51 62.53,21.83 79.82,21.83
TIM2_CH1: length 37
  Top Layer w0.381: U1.77 40.08,31.54 v1(40.04,31.5)
  Bottom Layer w0.381: v1(40.04,31.5) 25.94,31.5 23.41,34.03 5.47,34.03
TIM2_CH2: length 40.5
  Top Layer w0.254: 39.52,25.54 v1(39.28,25.78)
  Top Layer w0.381: U1.89 39.52,25.54
  Bottom Layer w0.381: v1(39.28,25.78) 38.39,26.67 38.39,29.46 36.84,31.01 25.28,31.01 23.52,32.78 5.47,32.78
TIM3_CH1: length 36.4
  Top Layer w0.355: U1.90 27.61,25.04 26.58,24 v1(19.72,24)
  Bottom Layer w0.355: v1(19.72,24) 5.61,24 CN11.3
TIM3_CH2: length 36.7
  Top Layer w0.355: U1.91 28.13,24.54 26.96,23.37 v1(20.48,23.37)
  Bottom Layer w0.355: v1(20.48,23.37) 6.72,23.37 5.97,22.62 CN11.2
TX: length 20.4
  Top Layer w0.381: v1(22.39,20.45) 20.86,20.45 15.91,25.4 v1(15.91,26.92) ; U10.3 18.7,33.15 17.82,32.26 v1(17.82,32.13)
  Bottom Layer w0.381: v1(22.39,20.45) U12.2 ; v1(15.91,26.92) 15.91,30.35 17.69,32.13 v1(17.82,32.13)
UART4_RX: length 5.3
  Bottom Layer w0.381: 28.07,45.35 28.07,50.41 27.9,50.57
UART4_RX(PA1): length 42.3
  Top Layer w0.254: v1(51.6,22.35) 53.93,20.02 U1.23 ; v1(32.42,34.16) 31.15,34.16 29.5,32.51 v1(27.72,32.51)
  Bottom Layer w0.254: R27.1 27.69,34.33 C39.2 27.69,32.55 v1(27.72,32.51) ; v1(51.6,22.35) 39.53,34.42 32.67,34.42 v1(32.42,34.16) ; 27.98,34.69 26.69,34.69 26.2,35.18 26.2,36.61 D10.2 28,36.74 R26.2
UART4_TX: length 5.2
  Bottom Layer w0.381: 29.25,45.44 29.25,50.48 29.15,50.57
UART4_TX(PA0): length 37.9
  Top Layer w0.254: v1(50.71,22.23) 53.43,19.5 U1.22
  Bottom Layer w0.254: v1(50.71,22.23) 40.8,32.13 30.47,32.13 C38.2 29.51,34.49 R28.1 30.97,34.62 31.29,34.94 D9.2 31.15,36.78 R25.2
UART8_RX(PE0): length 12.9
  Top Layer w0.355: v1(36.74,20.45) 37.83,21.54 U1.97
  Bottom Layer w0.355: C35.2 34.27,18.45 D8.2 ; v1(36.74,20.45) R23.1 35.8,19 35.34,18.54 34.36,18.54 D8.2 ; R22.2 33.36,19.47 D8.2
UART8_TX(PE1): length 12.8
  Top Layer w0.355: v1(38.26,20.45) 38.38,20.45 38.97,21.04 U1.98
  Bottom Layer w0.254: 34.28,23.59 D7.2
  Bottom Layer w0.355: C34.2 34.28,23.59 33.36,22.66 R21.2 ; v1(38.26,20.45) 37.69,20.45 36.41,21.72 R24.1 35.8,22.78 34.96,23.63 D7.2
USART1_RXD: length 11
  Top Layer w0.254: U1.54 53.43,34.49 53.12,34.8 53.12,35.18 52.74,35.56 v1(52.74,37.21)
  Bottom Layer w0.381: v1(52.74,37.21) 52.74,39.37 53.76,40.39 R4.1
USART1_TXD: length 6.4
  Top Layer w0.254: v1(53.5,35.69) 53.5,35.18 53.93,34.75 U1.53
  Bottom Layer w0.254: v1(53.5,35.69) 53.88,36.07 55.66,36.07 56.17,36.58 57.2,36.58 R5.1
USART2_RXD: length 6.1
  Top Layer w0.381: U1.25 54.93,17.5 v1(55.41,17.02)
  Bottom Layer w0.381: 57.57,13.84 56.93,13.84 56.55,14.22 56.55,15.88 v1(55.41,17.02)
USART2_TXD: length 10.4
  Top Layer w0.381: U1.24 54.43,16.73 v1(54.65,16.51)
  Bottom Layer w0.381: R12.1 56.8,10.03 55.92,10.92 55.92,15.37 55.79,15.37 v1(54.65,16.51)
USART3_RX(PB11): length 40.6
  Top Layer w0.254: U1.47 55.36,30.54 51.47,26.65 v1(51.47,25.02)
  Top Layer w0.381: CN13.2 74.98,19.44 73.7,18.16 v1(59.34,18.16)
  Bottom Layer w0.254: v1(51.47,25.02) 51.47,24 57.31,18.16 v1(59.34,18.16)
USART3_TX(PB10): length 38.8
  Top Layer w0.254: v1(52.11,25.78) 52.11,26.67 55.47,30.04 U1.46
  Top Layer w0.381: CN13.3 79.81,20.7 74.2,20.7 72.68,19.18 59.09,19.18 v1(58.96,19.05)
  Bottom Layer w0.254: v1(58.96,19.05) 57.19,19.05 52.11,24.13 v1(52.11,25.78)
USART6_RX: length 9
  Top Layer w0.381: CN8.2 79.69,27.95 74.61,27.95 74.6,27.94 70.9,27.94
USART6_RX(PC7): length 19.1
  Top Layer w0.254: D12.2 61.25,26.53 R30.2 ; v1(48.8,31.12) 48.43,31.49 U1.64
  Bottom Layer w0.254: v1(60.81,26.45) 60.81,26.48 59.93,27.36 R31.1 51.98,27.94 v1(48.8,31.12)
USART6_TX: length 9
  Top Layer w0.254: 74.6,29.21 74.61,29.2
  Top Layer w0.381: U17.3 79.7,29.21 CN8.3
USART6_TX(PC6): length 18.4
  Top Layer w0.254: R29.2 62.53,29.96 61.79,30.7 v1(60.81,30.7) ; v1(49.82,30.99) 48.93,31.88 U1.63
  Bottom Layer w0.254: v1(60.81,30.7) 59.93,29.82 R32.1 51.6,29.21 v1(49.82,30.99)
VCAP: length 20.7
  Top Layer w0.254: U1.73 43.93,32.69 44.36,32.26 46.14,32.26 48.17,30.23 50.96,30.23 51.77,31.04 U1.48 58.78,31.04 58.8,31.05
  Top Layer w0.33: v1(43.6,35.69) 43.93,35.35 U1.73
  Bottom Layer w0.33: C19.1 42.92,36.3 43.56,35.65 v1(43.6,35.69)
$1N1114: length 7.2
  Top Layer w0.381: v1(59.47,40.39) 62.52,40.39 63.28,41.15 U2.1
  Bottom Layer w0.381: R4.2 v1(59.47,40.39)
$1N1117: length 7.2
  Top Layer w0.381: v1(59.47,36.58) 61.5,36.58 62.27,37.34 U2.4
  Bottom Layer w0.381: R5.2 58.19,36.58 v1(59.47,36.58)
$1N6290: length 6.3
  Top Layer w0.381: v1(59.73,13.84) U5.1
  Bottom Layer w0.508: v1(59.73,13.84) R11.2
$1N6291: length 6.4
  Top Layer w0.381: v1(60.23,10.03) U5.4
  Bottom Layer w0.381: R12.2 v1(60.23,10.03)
$1N8850: length 13.2
  Top Layer w0.254: U6.7 44.49,45.04 44.49,47.12 ; 44.5,54.29 44.43,54.36 ; R14.2 44.5,47.31
  Top Layer w0.381: 44.5,47.31 44.5,54.29
  Bottom Layer w0.254: D3.1 44.15,54.07 44.43,54.36
$1N8867: length 13.7
  Top Layer w0.254: U6.6 45.62,47.39 45.67,47.39 R14.1
  Top Layer w0.381: 45.93,54.36 46,54.29 46,47.31 R14.1
  Bottom Layer w0.254: 45.93,54.36 46,54.29 46,50.83 D3.2
$1N8899: length 13.6
  Top Layer w0.254: R15.1 53.9,44.94 U7.7
  Top Layer w0.381: 53.85,54.43 53.97,54.31 53.97,47.07 R15.1
  Bottom Layer w0.254: D4.1 53.97,50.87 53.97,54.39 CN1.1
$1N8916: length 13.7
  Top Layer w0.254: R15.2 55.41,46.01 55.15,45.76 55.15,44.95 U7.6
  Top Layer w0.381: 55.35,54.43 55.47,54.31 55.47,47.06 R15.2
  Bottom Layer w0.254: D4.2 55.47,50.73 55.47,54.39 CN1.2
$1N11134: length 4.7
  Top Layer w0.508: LED1.1 25.26,8.76 24.67,8.76 v1(24.17,8.25)
  Bottom Layer w0.508: v1(24.17,8.25) 24.17,7.26 R17.2
$1N11471: length 4.8
  Bottom Layer w0.508: Q1.1 29.26,9.54 26.95,7.23 25.83,7.23
$1N11639: length 11.5
  Bottom Layer w0.381: R19.2 R20.1 34.79,9.87 Q2.1 32.72,10.41 32.21,10.92 27.98,10.92 27.36,10.31 Q1.2
$1N11829: length 7.3
  Bottom Layer w0.635: C22.2 34.07,5.46 D6.1 34.41,7.91 F1.2
  Bottom Layer w1.016: F2.1 F1.2
$1N22451: length 2.7
  Bottom Layer w0.381: U12.7 R22.1
$1N22455: length 2.7
  Bottom Layer w0.381: U12.6 R21.1
$1N23777: length 2.5
  Bottom Layer w0.254: R26.1 28.07,37.67 U16.7
$1N23780: length 2.5
  Bottom Layer w0.254: R25.1 29.34,37.67 29.34,40.15
$1N24358: length 2
  Top Layer w0.254: 65.35,27.94 65.23,27.81 R30.1
$1N24361: length 2
  Top Layer w0.254: R29.1 U17.6
$1N72268:
  vias: v1(67.6,4.08)
$1N72301:
  vias: v1(70.9,4.08)
$1N72334:
  vias: v1(74.08,4.15)
$1N72399:
  vias: v1(77,4.15)
$1N72715: length 2.5
  Top Layer w0.381: CN14.2 7.47,16.41 7.85,16.79
$1N72719: length 2.5
  Top Layer w0.381: CN14.3 7.5,15.16 7.85,14.81
$1N77269:
  vias: v1(81.79,4.3)
$1N77366:
  vias: v1(79.58,4.2)

## Copper pours and planes (outline as drawn; the poured copper is in the pictures)
3.3V on Top Layer: 47.03,4.06 47.03,0.25 53,0.25 52.99,0.38 52.99,4.06
3.3V on Bottom Layer: 51.47,4.06 51.47,0.25 54.39,0.25 54.39,4.06
AGND on Top Layer: 0,56 85.04,56 85.04,0.09 0,0.09
AGND on Bottom Layer: 0,56 85.04,56 85.04,0.09 85.13,0 0.16,0 0.16,55.84
AGND on GND: 84.75,56.01 84.75,0.25 0.29,0.25 0.16,0.13 0.16,55.75 0.04,55.88 84.62,55.88
AGND on VCC: 84.74,55.75 84.74,0.51 84.87,0.38 0.42,0.38 0.16,0.13 0.16,55.88 0.04,56.01 84.49,56.01
GND on Bottom Layer: 7.4,15.62 39.3,15.62 39.3,0.36 39.3,0.24 7.4,0.24
SGND4 on Bottom Layer: 20.99,25.78 20.99,16.86 35.89,16.86 35.98,16.76 35.98,25.91 21.12,25.91
IN_5+ on Bottom Layer: 15.02,15.69 15.02,12.83 25.91,12.83 27.32,11.42 36.1,11.42 36.1,15.69
$1N11475 on Bottom Layer: 21.88,6.22 26.2,6.22 26.2,3.81 21.88,3.81

Small or netless copper shapes (teardrops, artwork), in the pictures only: 281 on Top Layer, 258 on Bottom Layer, 3 on VCC

## Text on the board
Bottom Silkscreen Layer: PWM2 | PWM3 | PWM1 | USART4
Top Layer: by：标准五个字
Top Silkscreen Layer: +5V | GND | D0 | RX | TX | D1 | SDA | SCL | D2 | 5V | D3 | G | 3V3 | PC4 | RES | PC5 | DC | PB0 | CS | PB1 | BL | USART3 | RS-USART2 | USART6 | RS-USART1 | SWD | CAN1 | CAN2
